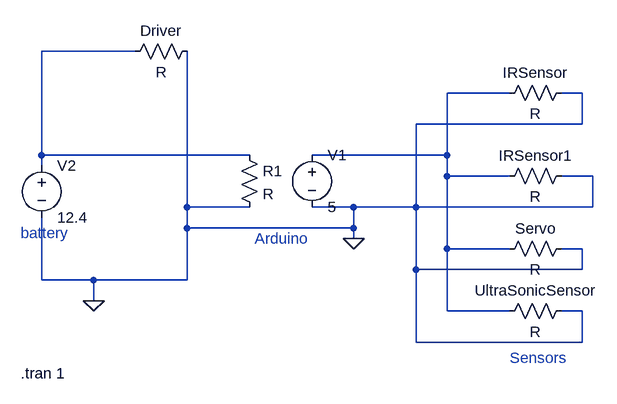
[diagram p0: schematic PowerWiring.asc]
PowerWiring.asc, the LTspice schematic file:
Version 4.1
SHEET 1 880 680
WIRE -496 -80 -640 -80
WIRE 80 -16 -16 -16
WIRE 192 -16 160 -16
WIRE 192 32 192 -16
WIRE 192 32 -64 32
WIRE -640 80 -640 -80
WIRE -320 80 -640 80
WIRE -16 80 -16 -16
WIRE -16 80 -224 80
WIRE -640 96 -640 80
WIRE -16 112 -16 80
WIRE 80 112 -16 112
WIRE 208 112 160 112
WIRE -416 160 -416 -80
WIRE -320 160 -416 160
WIRE -160 160 -224 160
WIRE -64 160 -64 32
WIRE -64 160 -160 160
WIRE 208 160 208 112
WIRE 208 160 -64 160
WIRE -416 192 -416 160
WIRE -160 192 -160 160
WIRE -160 192 -416 192
WIRE -160 208 -160 192
WIRE -16 224 -16 112
WIRE 80 224 -16 224
WIRE 192 224 160 224
WIRE -64 256 -64 160
WIRE 192 256 192 224
WIRE 192 256 -64 256
WIRE -640 272 -640 176
WIRE -560 272 -640 272
WIRE -416 272 -416 192
WIRE -416 272 -560 272
WIRE -560 304 -560 272
WIRE -16 320 -16 224
WIRE 80 320 -16 320
WIRE 192 320 160 320
WIRE -64 368 -64 256
WIRE 192 368 192 320
WIRE 192 368 -64 368
FLAG -560 304 0
FLAG -160 208 0
SYMBOL voltage -224 64 R0
WINDOW 123 0 0 Left 0
WINDOW 39 0 0 Left 0
SYMATTR InstName V1
SYMATTR Value 5
SYMBOL res -336 64 R0
SYMATTR InstName R1
SYMBOL voltage -640 80 R0
WINDOW 123 0 0 Left 0
WINDOW 39 0 0 Left 0
SYMATTR InstName V2
SYMATTR Value 12.4
SYMBOL res -400 -96 R90
WINDOW 0 0 56 VBottom 2
WINDOW 3 32 56 VTop 2
SYMATTR InstName Driver
SYMBOL res 176 -32 R90
WINDOW 0 0 56 VBottom 2
WINDOW 3 32 56 VTop 2
SYMATTR InstName IRSensor
SYMBOL res 176 96 R90
WINDOW 0 0 56 VBottom 2
WINDOW 3 32 56 VTop 2
SYMATTR InstName IRSensor1
SYMBOL res 176 208 R90
WINDOW 0 0 56 VBottom 2
WINDOW 3 32 56 VTop 2
SYMATTR InstName Servo
SYMBOL res 176 304 R90
WINDOW 0 0 56 VBottom 2
WINDOW 3 32 56 VTop 2
SYMATTR InstName UltraSonicSensor
TEXT -312 208 Left 2 ;Arduino
TEXT -672 200 Left 2 ;battery
TEXT 80 392 Left 2 ;Sensors
TEXT -672 416 Left 2 !.tran 1

The netlist it stands for:
* PowerWiring.asc
V1 N002 0 5
R1 N001 0 R
V2 N001 0 12.4
R§Driver 0 N001 R
R§IRSensor 0 N002 R
R§IRSensor1 0 N002 R
R§Servo 0 N002 R
R§UltraSonicSensor 0 N002 R
* Arduino
* battery
* Sensors
.tran 1
.backanno
.end